# Altium schematic sheet 08_EPROM_UNIQUE_SERIAL.SchDoc: =TitleParameter
size A3; Organization: ASISGUARD; Address1: Kemalpasa, Kemalpasa Cd. No:290 D:292H, 35060 Bornova/Izmir/Turkey
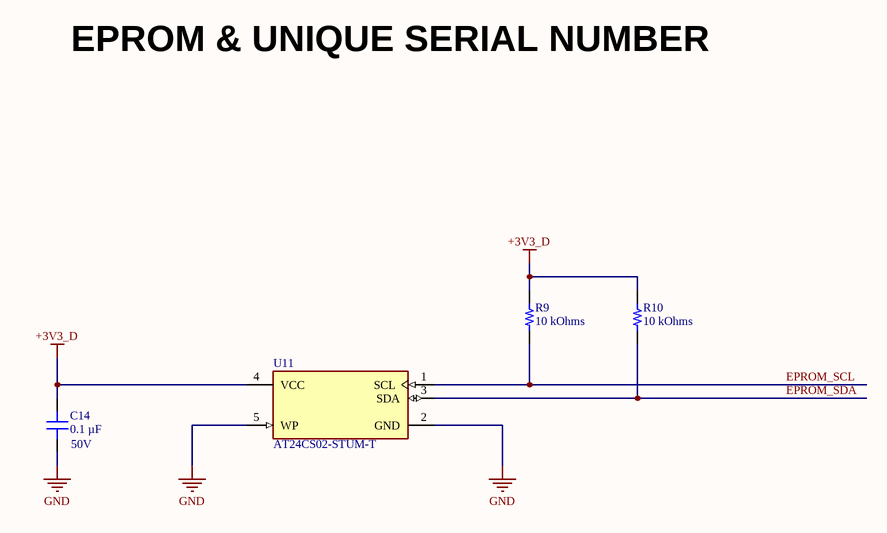
[diagram p0: 08_EPROM_UNIQUE_SERIAL.SchDoc]

## Parts
C14  Voltage - Rated: 50V  [CAP 0402_1005]  (hidden comment: 0.1 µF)
R9  10 kOhms  [RES 0402_1005]
R10  10 kOhms  [RES 0402_1005]
U11  AT24CS02-STUM-T  [FP-C04-21344-MFG]

## Nets
+3V3_D: C14.2 R9.2 R10.2 U11.4(VCC)
GND: C14.1 U11.2(GND) U11.5(WP)
EPROM_SCL: R9.1 U11.1(SCL)
EPROM_SDA: R10.1 U11.3(SDA)

## Notes on the sheet
- EPROM & UNIQUE SERIAL NUMBER
- Proje/Project:
- Sayfa Adı/Document Name:
- Çizilme Tarihi/Drawing Date
- E. CAGLAV
- Tasarlayan/Designed By
- Sayfa/Sheet:
- Revision:
- of
- Son Güncelleme/Last Edit Date
- Kontrol eden/Checked By
- Onaylayan/Approved By
- Boyut/Size:
- Varyant/Variant:
- Dil/Language:
- A3
- ENG

## Library data of the parts
C14 = GCM155R71H104KE02J: CAP CER 0.1UF 50V X7R 0402; manufacturer: Murata Electronics; Tolerance: ±10%; Part Number: GCM155R71H104KE02J; Capacitance: 0.1 µF; Applications: Automotive; componentlink1description: Datasheet; componentlink1url: https://search.murata.co.jp/Ceramy/image/img/A01X/G101/ENG/GCM155R71H104KE02-01.pdf; componentlink2description: DigiKey Link; componentlink2url: https://www.digikey.com/en/products/detail/murata-electronics/GCM155R71H104KE02J/4903705; Device Package: 0402 (1005 Metric); lastupdated: 4/6/2026 7:10:30 PM; Lifecycle Status: Active; Minimum Order: 1; Mounting Type: Surface Mount, MLCC; Operating Temperature: -55°C ~ 125°C; Package / Case: 0402 (1005 Metric); packaging: TapeAndReel; partid: 11356; Part Status: Active; price: 0.01; Ratings: AEC-Q200; series: GCM; Size / Dimension: 0.039" L x 0.020" W (1.00mm x 0.50mm); Supplier 1: DigiKey; Supplier Part Number 1: 490-14514-1-ND; Temperature Coefficient: X7R; Thickness (Max): 0.022" (0.55mm); value: 0.1 µF
R9 R10 = RC0402FR-0710KL: RES 10K OHM 1% 1/16W 0402; Manufacturer: Yageo; Power (Watts): 0.063W, 1/16W; Temperature Coefficient: ±100ppm/°C; Part Number: RC0402FR-0710KL; Value: 10 kOhms; ComponentLink1Description: Datasheet; ComponentLink1URL: https://www.yageo.com/upload/media/product/productsearch/datasheet/rchip/PYu-RC_Group_51_RoHS_L_10.pdf; ComponentLink2Description: DigiKey Link; ComponentLink2URL: https://www.digikey.com/en/products/detail/yageo/RC0402FR-0710KL/726523; Composition: Thick Film; Device Package: 0402 (1005 Metric); Features: Moisture Resistant; Height - Seated (Max): 0.016" (0.40mm); LastUpdated: 4/6/2026 7:41:07 PM; Lifecycle Status: Active; Minimum Order: 1; Number of Terminations: 2; Operating Temperature: -55°C ~ 155°C; Package / Case: 0402 (1005 Metric); Packaging: CutTape; PartId: 17593; Part Status: Active; Price: 0.01; Resistance: 10 kOhms; Series: RC_L; Size / Dimension: 0.039" L x 0.020" W (1.00mm x 0.50mm); Supplier 1: DigiKey; Supplier Part Number 1: 311-10.0KLRCT-ND; Supplier Device Package: 0402; Tolerance: ±1%
U11 = CMP-06313-000046-1: IC EEPROM 2K I2C 1MHZ SOT23-5